# Altium schematic sheet PATTERN-GENERATOR-NODE-SCH.SchDoc
size D; Author: Ehsan Shaghaei; CompanyName: Innopolis; Engineer: Ehsan Shaghaei; Organization: Innopolis Unmanned Tech. Labs; SheetNumber: 1; SheetTotal: 1
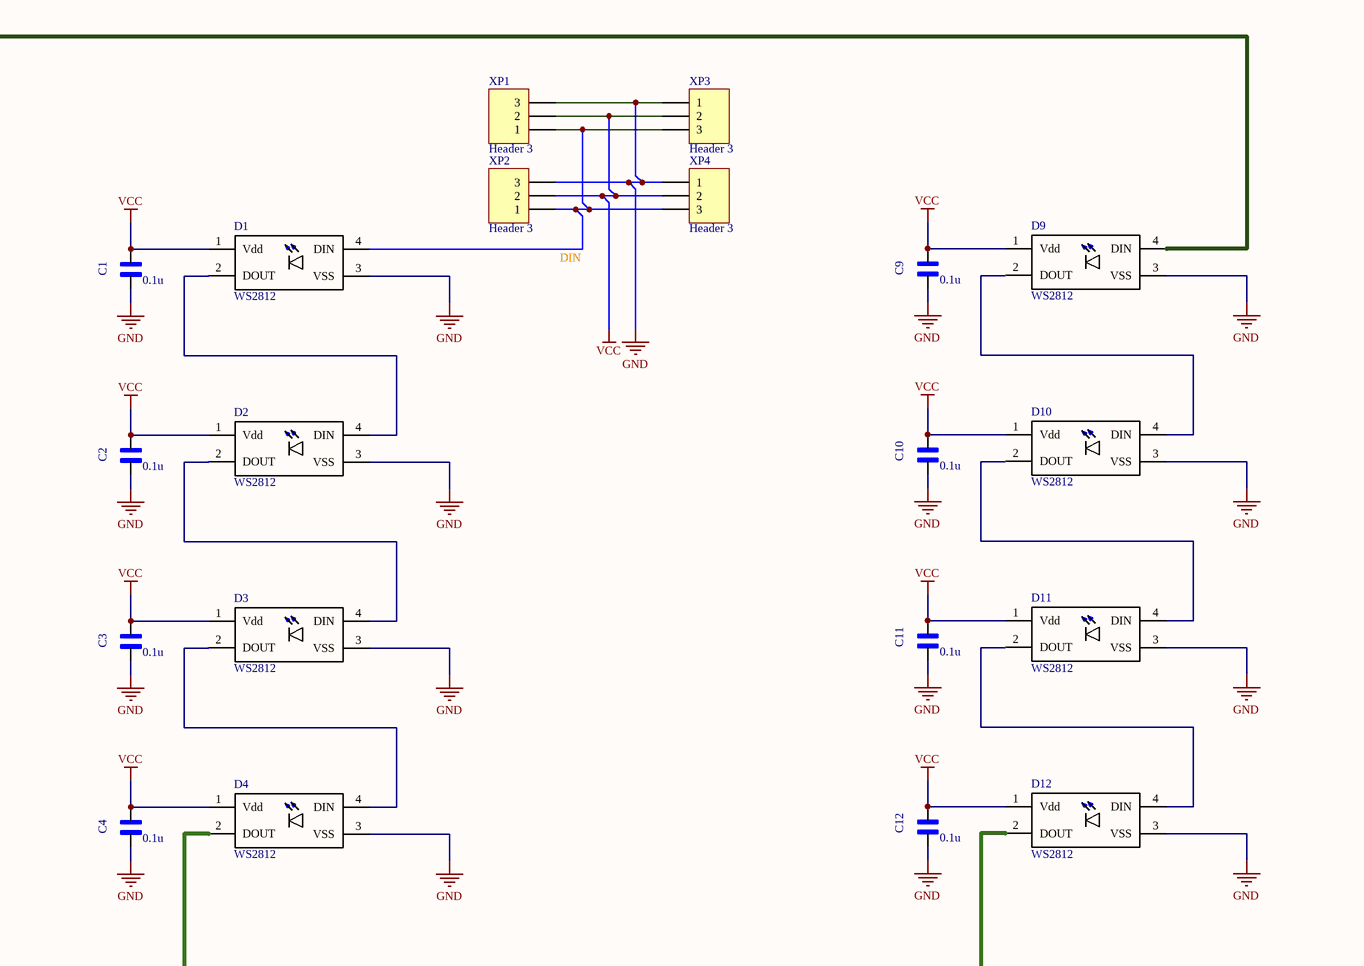
[diagram p0: PATTERN-GENERATOR-NODE-SCH.SchDoc, top left]
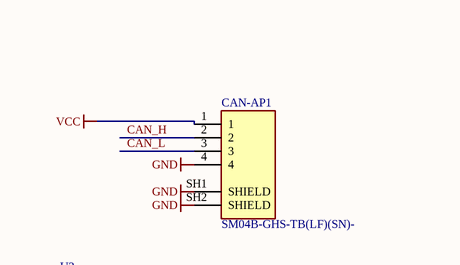
[diagram p1: PATTERN-GENERATOR-NODE-SCH.SchDoc, top right]
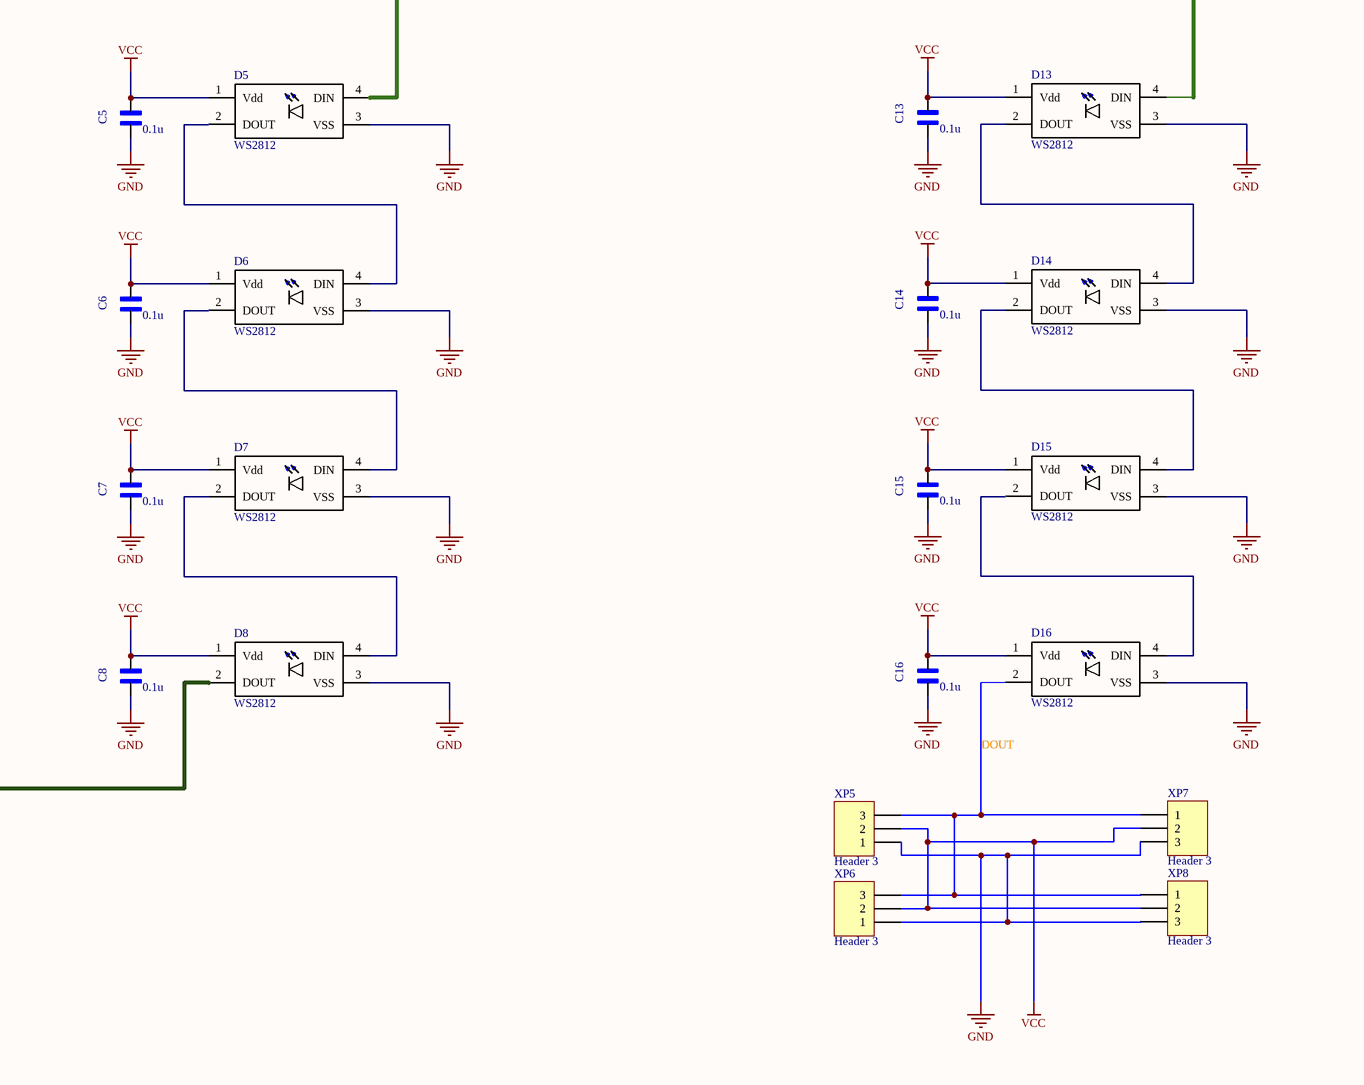
[diagram p2: PATTERN-GENERATOR-NODE-SCH.SchDoc, bottom left]
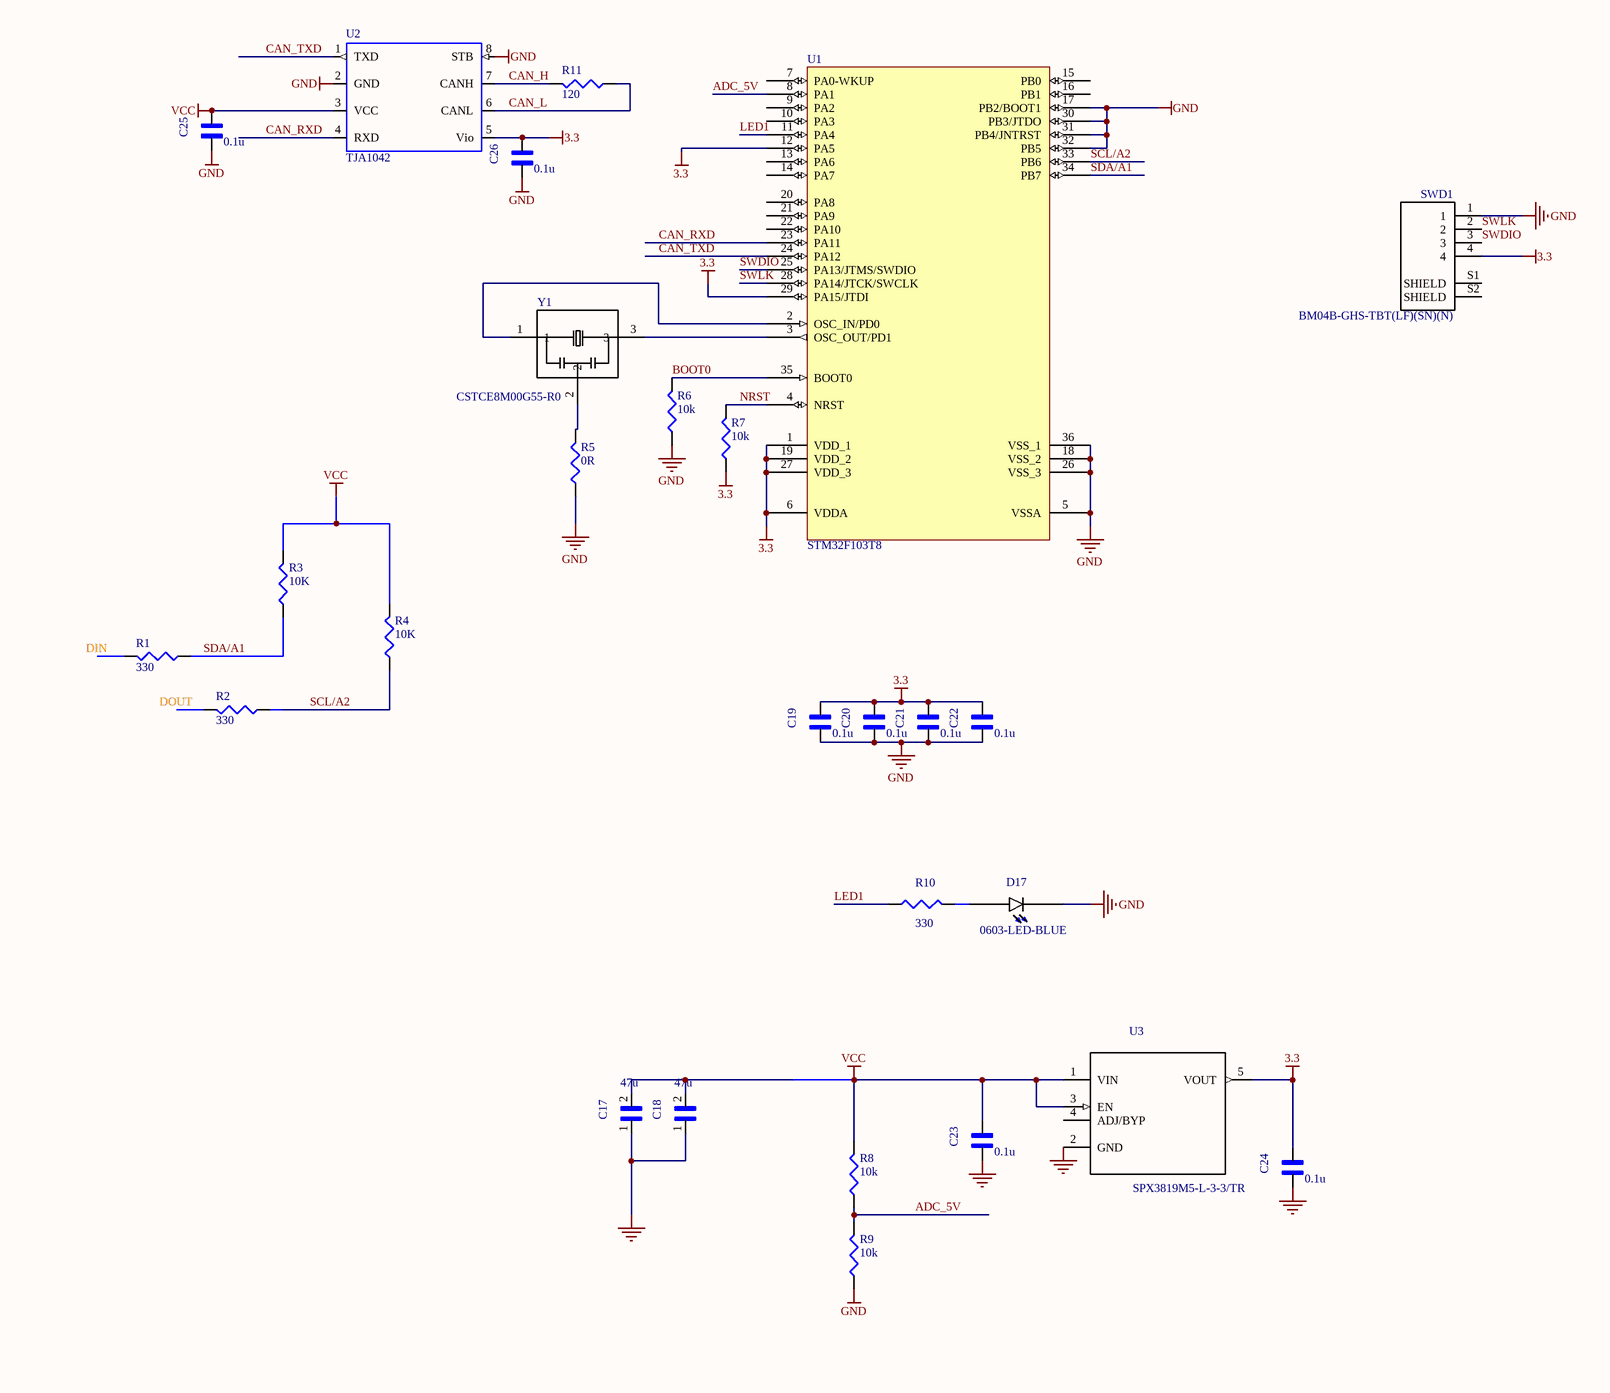
[diagram p3: PATTERN-GENERATOR-NODE-SCH.SchDoc, bottom right]

## Parts
C1  value 0.1u  [*CAPC1608X90]  (hidden comment: GX035C104MAT2-500)
C2  value 0.1u  [*CAPC1608X90]  (hidden comment: GX035C104MAT2-500)
C3  value 0.1u  [*CAPC1608X90]  (hidden comment: GX035C104MAT2-500)
C4  value 0.1u  [*CAPC1608X90]  (hidden comment: GX035C104MAT2-500)
C5  value 0.1u  [*CAPC1608X90]  (hidden comment: GX035C104MAT2-500)
C6  value 0.1u  [*CAPC1608X90]  (hidden comment: GX035C104MAT2-500)
C7  value 0.1u  [*CAPC1608X90]  (hidden comment: GX035C104MAT2-500)
C8  value 0.1u  [*CAPC1608X90]  (hidden comment: GX035C104MAT2-500)
C9  value 0.1u  [*CAPC1608X90]  (hidden comment: GX035C104MAT2-500)
C10  value 0.1u  [*CAPC1608X90]  (hidden comment: GX035C104MAT2-500)
C11  value 0.1u  [*CAPC1608X90]  (hidden comment: GX035C104MAT2-500)
C12  value 0.1u  [*CAPC1608X90]  (hidden comment: GX035C104MAT2-500)
C13  value 0.1u  [*CAPC1608X90]  (hidden comment: GX035C104MAT2-500)
C14  value 0.1u  [*CAPC1608X90]  (hidden comment: GX035C104MAT2-500)
C15  value 0.1u  [*CAPC1608X90]  (hidden comment: GX035C104MAT2-500)
C16  value 0.1u  [*CAPC1608X90]  (hidden comment: GX035C104MAT2-500)
C17  value 47u  [*CAPC3216X125N]  (hidden comment: GRM31CR61A476KE15L)
C18  value 47u  [*CAPC3216X125N]  (hidden comment: GRM31CR61A476KE15L)
C19  value 0.1u  [*CAPC1608X90]  (hidden comment: GX035C104MAT2-500)
C20  value 0.1u  [*CAPC1608X90]  (hidden comment: GX035C104MAT2-500)
C21  value 0.1u  [*CAPC1608X90]  (hidden comment: GX035C104MAT2-500)
C22  value 0.1u  [*CAPC1608X90]  (hidden comment: GX035C104MAT2-500)
C23  value 0.1u  [*CAPC1608X90]  (hidden comment: GX035C104MAT2-500)
C24  value 0.1u  [*CAPC1608X90]  (hidden comment: GX035C104MAT2-500)
C25  value 0.1u  [*CAPC1608X90]  (hidden comment: GX035C104MAT2-500)
C26  value 0.1u  [*CAPC1608X90]  (hidden comment: GX035C104MAT2-500)
CAN-AP1  SM04B-GHS-TB(LF)(SN)-  [JST_SM04B-GHS-TB(LF)(SN)-]
D1  WS2812  [LED_WS2812]
D2  WS2812  [LED_WS2812]
D3  WS2812  [LED_WS2812]
D4  WS2812  [LED_WS2812]
D5  WS2812  [LED_WS2812]
D6  WS2812  [LED_WS2812]
D7  WS2812  [LED_WS2812]
D8  WS2812  [LED_WS2812]
D9  WS2812  [LED_WS2812]
D10  WS2812  [LED_WS2812]
D11  WS2812  [LED_WS2812]
D12  WS2812  [LED_WS2812]
D13  WS2812  [LED_WS2812]
D14  WS2812  [LED_WS2812]
D15  WS2812  [LED_WS2812]
D16  WS2812  [LED_WS2812]
D17  0603-LED-BLUE  [*LEDM1608X80_LTE-C1906R-14(Primary)]
R1  value 330  [J1-0603]  (hidden comment: Res3)
R2  value 330  [J1-0603]  (hidden comment: Res3)
R3  value 10K  [J1-0603]  (hidden comment: Res3)
R4  value 10K  [J1-0603]  (hidden comment: Res3)
R5  value 0R  [J1-0603]  (hidden comment: RC0603FR-0710KL)
R6  value 10k  [J1-0603]  (hidden comment: RC0603FR-0710KL)
R7  value 10k  [J1-0603]  (hidden comment: RC0603FR-0710KL)
R8  value 10k  [J1-0603]  (hidden comment: RC0603FR-0710KL)
R9  value 10k  [J1-0603]  (hidden comment: RC0603FR-0710KL)
R10  value 330  [J1-0603]  (hidden comment: Res3)
R11  value 120  [J1-0603]  (hidden comment: Res3)
SWD1  BM04B-GHS-TBT(LF)(SN)(N)  [JST_BM04B-GHS-holes]
U1  STM32F103T8  [*QFN50P600X600X100-37N]
U2  TJA1042  [SOT782-1]
U3  SPX3819M5-L-3-3/TR  [*SOT95P280X145-5N]
XP1  Header 3  [HDR Side 3 pin]
XP2  Header 3  [HDR Side 3 pin]
XP3  Header 3  [HDR Side 3 pin]
XP4  Header 3  [HDR Side 3 pin]
XP5  Header 3  [HDR Side 3 pin]
XP6  Header 3  [HDR Side 3 pin]
XP7  Header 3  [HDR Side 3 pin]
XP8  Header 3  [HDR Side 3 pin]
Y1  CSTCE8M00G55-R0  [*OSC_CSTCE8M00G55-R0]

## Nets
3.3: C19.1 C20.1 C21.1 C22.1 C24.1 C26.1 R7.1 SWD1.4 U1.1(VDD_1) U1.6(VDDA) U1.12(PA5) U1.19(VDD_2) U1.27(VDD_3) U1.29(PA15/JTDI) U2.5(Vio) U3.5(VOUT)
GND: C1.2 C2.2 C3.2 C4.2 C5.2 C6.2 C7.2 C8.2 C9.2 C10.2 C11.2 C12.2 C13.2 C14.2 C15.2 C16.2 C17.1 C18.1 C19.2 C20.2 C21.2 C22.2 C23.2 C24.2 C25.2 C26.2 CAN-AP1.4 CAN-AP1.SH1(SHIELD) CAN-AP1.SH2(SHIELD) D1.3(VSS) D2.3(VSS) D3.3(VSS) D4.3(VSS) D5.3(VSS) D6.3(VSS) D7.3(VSS) D8.3(VSS) D9.3(VSS) D10.3(VSS) D11.3(VSS) D12.3(VSS) D13.3(VSS) D14.3(VSS) D15.3(VSS) D16.3(VSS) D17.C R5.1 R6.1 R9.1 SWD1.1 U1.5(VSSA) U1.17(PB2/BOOT1) U1.18(VSS_2) U1.26(VSS_3) U1.30(PB3/JTDO) U1.31(PB4/JNTRST) U1.32(PB5) U1.36(VSS_1) U2.2(GND) U2.8(STB) U3.2(GND) XP1.3 XP2.3 XP3.1 XP4.1 XP5.1 XP6.1 XP7.3 XP8.3
VCC: C1.1 C2.1 C3.1 C4.1 C5.1 C6.1 C7.1 C8.1 C9.1 C10.1 C11.1 C12.1 C13.1 C14.1 C15.1 C16.1 C17.2 C18.2 C23.1 C25.1 CAN-AP1.1 D1.1(Vdd) D2.1(Vdd) D3.1(Vdd) D4.1(Vdd) D5.1(Vdd) D6.1(Vdd) D7.1(Vdd) D8.1(Vdd) D9.1(Vdd) D10.1(Vdd) D11.1(Vdd) D12.1(Vdd) D13.1(Vdd) D14.1(Vdd) D15.1(Vdd) D16.1(Vdd) R3.2 R4.2 R8.2 U2.3(VCC) U3.1(VIN) U3.3(EN) XP1.2 XP2.2 XP3.2 XP4.2 XP5.2 XP6.2 XP7.2 XP8.2
ADC_5V: R8.1 R9.2 U1.8(PA1)
BOOT0: R6.2 U1.35(BOOT0)
CAN_H: CAN-AP1.2 R11.2 U2.7(CANH)
CAN_L: CAN-AP1.3 R11.1 U2.6(CANL)
CAN_RXD: U1.23(PA11) U2.4(RXD)
CAN_TXD: U1.24(PA12) U2.1(TXD)
DIN: D1.4(DIN) R1.2 XP1.1 XP2.1 XP3.3 XP4.3
DOUT: D16.2(DOUT) R2.2 XP5.3 XP6.3 XP7.1 XP8.1
LED1: R10.1 U1.11(PA4)
NRST: R7.2 U1.4(NRST)
SCL/A2: R2.1 R4.1 U1.33(PB6)
SDA/A1: R1.1 R3.1 U1.34(PB7)
SWDIO: SWD1.3 U1.25(PA13/JTMS/SWDIO)
SWLK: SWD1.2 U1.28(PA14/JTCK/SWCLK)
NetD1_2: D1.2(DOUT) D2.4(DIN)
NetD2_2: D2.2(DOUT) D3.4(DIN)
NetD3_2: D3.2(DOUT) D4.4(DIN)
NetD4_2: D4.2(DOUT) D5.4(DIN)
NetD5_2: D5.2(DOUT) D6.4(DIN)
NetD6_2: D6.2(DOUT) D7.4(DIN)
NetD7_2: D7.2(DOUT) D8.4(DIN)
NetD8_2: D8.2(DOUT) D9.4(DIN)
NetD9_2: D9.2(DOUT) D10.4(DIN)
NetD10_2: D10.2(DOUT) D11.4(DIN)
NetD11_2: D11.2(DOUT) D12.4(DIN)
NetD12_2: D12.2(DOUT) D13.4(DIN)
NetD13_2: D13.2(DOUT) D14.4(DIN)
NetD14_2: D14.2(DOUT) D15.4(DIN)
NetD15_2: D15.2(DOUT) D16.4(DIN)
NetD17_A: D17.A R10.2
NetR5_2: R5.2 Y1.2
NetU1_2: U1.2(OSC_IN/PD0) Y1.1
NetU1_3: U1.3(OSC_OUT/PD1) Y1.3

Not connected (* = marked no-connect by the designer): SWD1 S1(SHIELD) S2(SHIELD); U1 7(PA0-WKUP) 9(PA2) 10(PA3) 13(PA6) 14(PA7) 15(PB0) 16(PB1) 20(PA8) 21(PA9) 22(PA10); U3 4(ADJ/BYP)

## Library data of the parts
C1-C16 C19-C22 C25 C26 = GX035C104MAT2-500: Cap Thin Film 0.1uf 50v 0603; MF: AVX; MP: GX035C104MAT2-500 or CL10B104JB8NNNC; Pacage Metric: 1608; Type: SMD; Package: 0603 AVX; SnapEDA_Link: https://www.snapeda.com/parts/GX035C104MAT2-500/AVX/view-part/?ref=snap
C17 C18 = GRM31CR61A476KE15L: Multilayer Ceramic Capacitor, GRM Series, 47 - F, - 10%, X5R, 10 V, 1206 [3216 Metric]; MF: Murata Electronics; Type: SMD; Package: 1206 Murata Electronics; MP: GRM31CR61A476KE15L; SnapEDA_Link: https://www.snapeda.com/parts/GRM31CR61A476KE15L/Murata%20Electronics%20North%20America/view-part/?ref=snap
C23 C24 = GX035C104MAT2-500: Cap Thin Film 0.1uf 50v 0603; MF: AVX; Pacage Metric: 1608; Type: SMD; Package: 0603 AVX; MP: GX035C104MAT2-500; SnapEDA_Link: https://www.snapeda.com/parts/GX035C104MAT2-500/AVX/view-part/?ref=snap
CAN-AP1 = SM04B-GHS-TB(LF)(SN)-: Connector Header Surface Mount, Right Angle 4 position 0.049 _1.25mm_; MF: JST Sales; MP: SM04B-GHS-TB(LF)(SN); Package: None; Value: *; SnapEDA_Link: https://www.snapeda.com/parts/SM04B-GHS-TB%28LF%29%28SN%29-/JST%20Sales%20America%20Inc./view-part/2759740/?ref=snap; HelpURL: http://www.farnell.com/datasheets/2082975.pdf; System: Connector; ChipDip_Link: https://www.chipdip.ru/product/sm04b-ghs-tb-lf-sn-gh-1.25mm-header-side-ent
D1-D16 = WS2812: Addressable Lighting - 5 LED Discrete Serial _Shift Register_ Red, Green, Blue _RGB_ 5.00mm Dia; MF: SparkFun Electronics; Availability: Unavailable; MP: WS2812; Price: None; Value: *; SnapEDA_Link: https://www.snapeda.com/parts/WS2812/SparkFun%20Electronics/view-part/106391/?ref=snap; Package: SparkFun Electronics; HelpURL: https://static.chipdip.ru/lib/554/DOC001554925.pdf; ChipDip_Link: https://www.chipdip.ru/product/ws2812b
D17 = LTE-C1906R-14: LED IrLED Chip LED 2-Pin SMD T/R; Package: 0603 Lite-On; MP: 0603-LED-BLUE; SnapEDA_Link: https://www.snapeda.com/parts/LTE-C1906R-14/Lite-On%20Inc./view-part/?ref=snap; Value: *; Type: SMD
R1-R4 = Res3: Resistor; Pacage Metric: 1608; MP: 4.7K 1% 0603; ChipDip_Link: https://www.chipdip.ru/product0/9000079736; HelpURL: https://www.chipdip.ru/product0/9000079736; Package: R0603; Type: SMD
R5-R9 = RC0603FR-0710KL: 10 kOhms 1 0.1 W 1 10 W Chip Resistor 0603 1608 Metric Thick Film; Pacage Metric: 1608; MF: Yageo or NXP; MP: 10K 1% 0603; ChipDip_Link: https://www.chipdip.ru/product0/9000079736; HelpURL: https://www.chipdip.ru/product0/9000079736; Package: R0603; Type: SMD; SnapEDA_Link: https://www.snapeda.com/parts/RC0603FR-0710KL/Yageo/view-part/?ref=dk&t=RC0603FR-0710KL&con_ref=None
R10 = Res3: Resistor; Pacage Metric: 1608; MP: RC0603FR-07330RL; ChipDip_Link: https://www.chipdip.ru/product0/9000079628; HelpURL: https://www.chipdip.ru/product0/9000079628; Package: R0603; Type: SMD
R11 = Res3: 120 Ohms 1 0.1 W 1 10 W Chip Resistor 0603 1608 Metric Thick Film; Pacage Metric: 1608; MP: RC0603FR-07120RL; ChipDip_Link: https://www.chipdip.ru/product0/9000079618; HelpURL: https://www.chipdip.ru/product0/9000079618; Package: R0603; Type: SMD
SWD1 = BM04B-GHS-TBT(LF)(SN)(N): Conn Shrouded Header HDR 4 POS 1.25mm Solder ST SMD Reel; MF: JST Sales; MP: SM04B-GHS-TB(LF)(SN); Instructions: Do not install; System: Connector; SnapEDA_Link: https://www.snapeda.com/parts/BM04B-GHS-TBT%28LF%29%28SN%29%28N%29/JST%20Sales%20America%20Inc./view-part/?ref=snap; Package: None; Value: *; Type: SMD
U1 = STM32F103T8: STM32F103T8U6, Микроконтроллер 32BIT ARM 64K FLASH [VFQFPN-36]; MF: STM; ChipDip_Link: https://www.chipdip.ru/product/stm32f103t8u6-2; HelpURL: http://www.st.com/stonline/products/literature/ds/13587.pdf; MP: STM32F103T8U6; Package: VFQFPN-36; SnapEDA_Link: https://www.snapeda.com/parts/STM32F103T8U6TR/STMicroelectronics/view-part/?ref=search&t=STM32F103T8U6; Type: SMD
U2 = TJA1042: 1/1 Transceiver Half CANbus 8-SO; MF: NXP USA; SnapEDA_Link: https://www.snapeda.com/parts/TJA1042/NXP%20USA%20Inc./view-part/900919/?ref=snap; Value: *; MP: TJA1042; Package: VDFN-8 NXP USA; ChipDip_Link: https://www.chipdip.ru/product1/8002840332; HelpURL: https://static.chipdip.ru/lib/583/DOC001583059.pdf; Type: SMD
U3 = SPX3819M5-L: Low Dropout Voltage Regulator, Adjustable 0.5A, В±1%, 2.5 to 16 Vin, 5-Pin SOT-23; MF: MaxLinear, Inc.; Value: 3V3; MP: SPX3819M5-L-3-3/TR; Package: SOT-23-5 Exar; SnapEDA_Link: https://www.snapeda.com/parts/SPX3819M5-L/MaxLinear%2C%20Inc./view-part/?ref=snap; Type: SMD; ChipDip_Link: https://www.chipdip.ru/product1/8003455237; HelpURL: http://www.farnell.com/datasheets/2614478.pdf
XP1-XP8 = Header 3: Header, 3-Pin; LatestRevisionDate: 17-Jul-2002; LatestRevisionNote: Re-released for DXP Platform.; Publisher: Altium Limited
Y1 = CSTCE8M00G55-R0: Ceramic Resonator 8MHz ??0.5% _Tol_ ??0.2% _Stability_ 33pF 40Ohm 3-Pin CSMD T/R; MF: Murata; MP: CSTCE8M00G55-R0; Package: SMD-3 Murata; SnapEDA_Link: https://www.snapeda.com/parts/CSTCE8M00G55-R0/Murata%20Electronics%20North%20America/view-part/?ref=snap; Value: *; ChipDip_Link: https://www.chipdip.ru/product1/8001783721; HelpURL: https://www.murata.com/en-eu/api/pdfdownloadapi?cate=&partno=CSTCE8M00G55-R0; Type: SMD